# Altium schematic sheet UWB_IMU.SchDoc
size A4; SheetNumber: 2; SheetTotal: 3
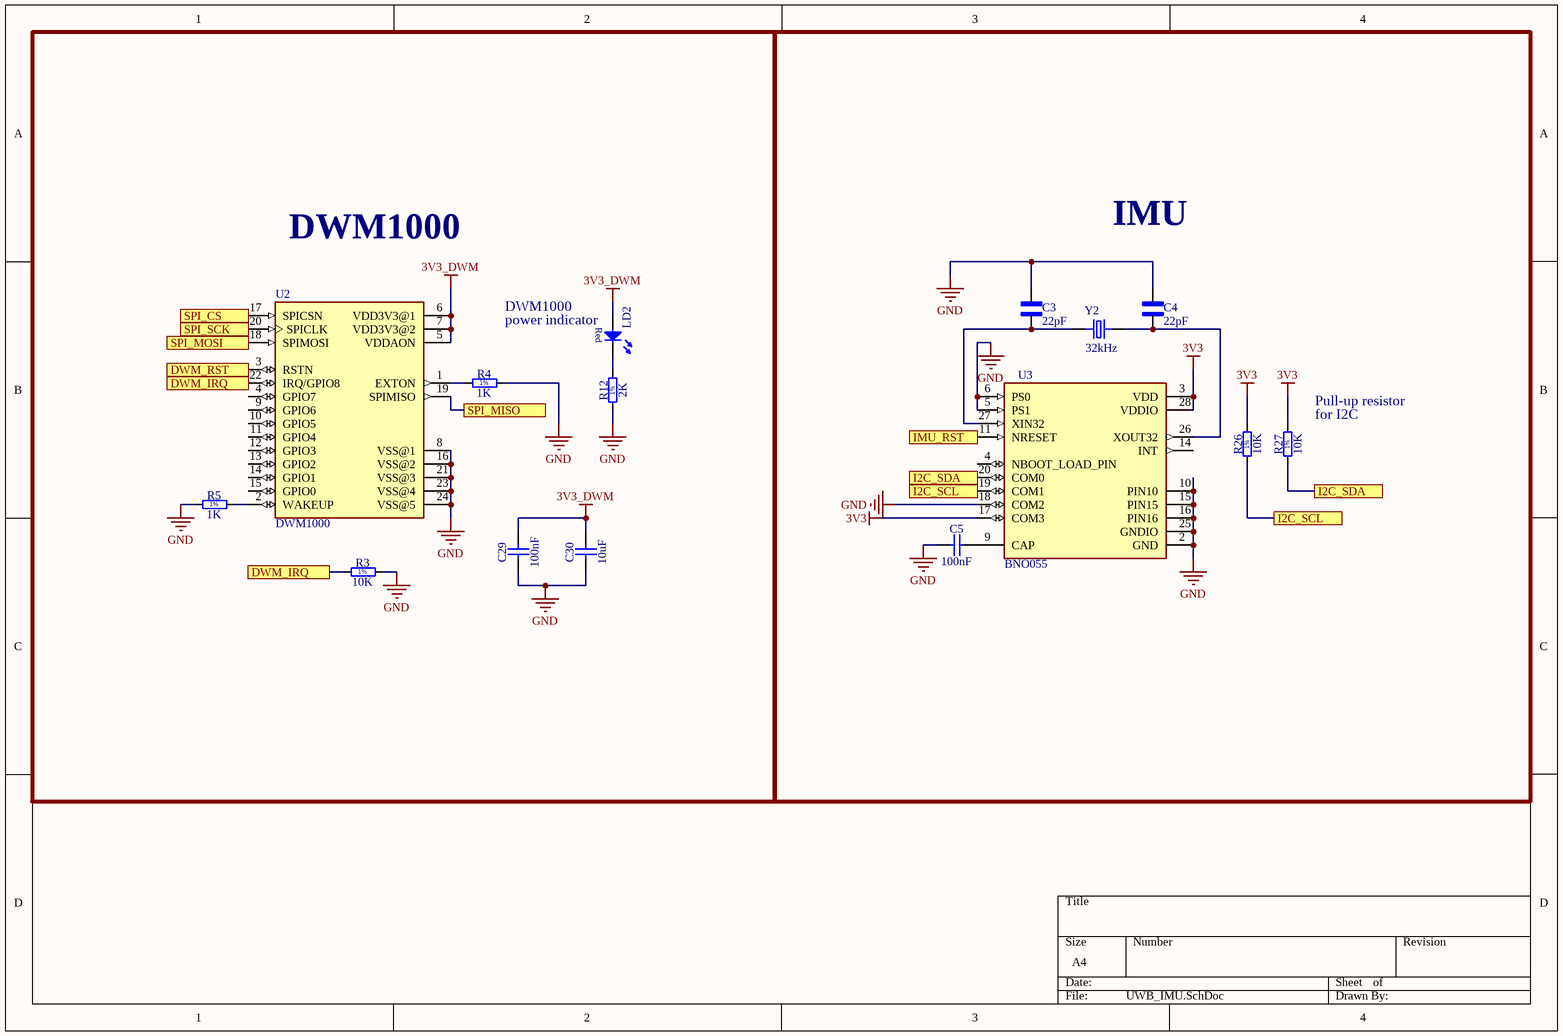
[diagram p0: UWB_IMU.SchDoc]

## Parts
C3  22pF  [CAPC1005X55N]
C4  22pF  [CAPC1005X55N]
C5  100nF  [0603C]
C29  100nF  [0603C]
C30  10uF  [0603C]
LD2  (no value)  [0603 LED]
R3  10K  [0603R]
R4  1K  [0603R]
R5  1K  [0603R]
R12  2K  [0603R]
R26  10K  [0603R]
R27  10K  [0603R]
U2  DWM1000  [XCVR_DWM1000]
U3  BNO055  [LGA28R50P4X10_380X520X100]
Y2  32kHz  [XTAL_ECS-.327-6-34RR-TR]

## Blocks framed on the sheet
DWM1000: C29 C30 LD2 R3-R5 R12 U2
IMU: C3-C5 R26 R27 U3 Y2

## Ports
DWM_IRQ, DWM_RST, I2C_SCL, I2C_SDA, IMU_RST, SPI_CS, SPI_MISO, SPI_MOSI, SPI_SCK

## Nets
3V3: R26.2 R27.2 U3.3(VDD) U3.17(COM3) U3.28(VDDIO)
3V3_DWM: C29.2 C30.2 LD2.2(A) U2.5(VDDAON) U2.6(VDD3V3@1) U2.7(VDD3V3@2)
GND: C3.2 C4.2 C5.1 C29.1 C30.1 R3.2 R4.2 R5.1 R12.1 U2.8(VSS@1) U2.16(VSS@2) U2.21(VSS@3) U2.23(VSS@4) U2.24(VSS@5) U3.2(GND) U3.5(PS1) U3.6(PS0) U3.10(PIN10) U3.15(PIN15) U3.16(PIN16) U3.18(COM2) U3.25(GNDIO)
DWM_IRQ: R3.1 U2.22(IRQ/GPIO8) ; port DWM_IRQ
DWM_RST: U2.3(RSTN) ; port DWM_RST
I2C_SCL: R26.1 U3.19(COM1) ; port I2C_SCL
I2C_SDA: R27.1 U3.20(COM0) ; port I2C_SDA
IMU_RST: U3.11(NRESET) ; port IMU_RST
SPI_CS: U2.17(SPICSN) ; port SPI_CS
SPI_MISO: U2.19(SPIMISO) ; port SPI_MISO
SPI_MOSI: U2.18(SPIMOSI) ; port SPI_MOSI
SPI_SCK: U2.20(SPICLK) ; port SPI_SCK
NetC3_1: C3.1 U3.27(XIN32) Y2.1(I/O)
NetC4_1: C4.1 U3.26(XOUT32) Y2.2(O/I)
NetC5_2: C5.2 U3.9(CAP)
NetLD2_1: LD2.1(C) R12.2
NetR4_1: R4.1 U2.1(EXTON)
NetR5_2: R5.2 U2.2(WAKEUP)

Not connected (* = marked no-connect by the designer): U2 4(GPIO7) 9(GPIO6) 10(GPIO5) 11(GPIO4) 12(GPIO3) 13(GPIO2) 14(GPIO1) 15(GPIO0); U3 4(NBOOT_LOAD_PIN) 14(INT)

## Notes on the sheet
- DWM1000
- (near LD2) power indicator
- (near R27) Pull-up resistor
- (near R27) for I2C
- (in symbol LED Red 1C 2A) Red
- (in symbol Resistor - 1%_1) 1%

## Library data of the parts
C3 C4 = 0402N100J500CT: 10 pF Â±5% 50V Ceramic Capacitor C0G, NP0 0402 (1005 Metric); MF: Walsin Technology; SnapEDA_Link: https://www.snapeda.com/parts/0402N100J500CT/Walsin+Technologies/view-part/?ref=snap; Package: 0402 Walsin Technologies; Value: *; MP: 0402N100J500CT; Check_prices: https://www.snapeda.com/parts/0402N100J500CT/Walsin+Technologies/view-part/?ref=eda
C5 C29 C30 = Capacitor - non polarized: Non-polarised capacitor
LD2 = LED Red 1C 2A
R3-R5 R12 R26 R27 = Resistor - 1%_1: Resistor - 1%
U2 = DWM1000: 802.15.4 IR-UWB Transceiver Module 3.5GHz ~ 6.5GHz Integrated, Chip Surface Mount; MF: Decawave Limited; Package: Module Decawave; Availability: Unavailable; Value: *; MP: DWM1000; SnapEDA_Link: https://www.snapeda.com/parts/DWM1000/Decawave%20Limited/view-part/327593/?ref=snap; Price: None
U3 = BNO055: BNO055 9-axis Absolute Orientation Sensor ( SiP ) w/Sensors and Sensor Fusion; Package: None; Price: None; Value: *; MP: BNO055; Availability: Unavailable
Y2 = ECS-.327-6-34RR-TR: 32.768kHz 20ppm Crystal 6pF 20 kOhm -40C ~ 85C Surface Mount 2-SMD, No Lead 3.2 x 1.5; MF: ECS Inc.; SnapEDA_Link: https://www.snapeda.com/parts/ECS-.327-6-34RR-TR/ECS/view-part/?ref=snap; Package: ECX-34RR-34RR-2 ECS; Value: *; MP: ECS-.327-6-34RR-TR; Check_prices: https://www.snapeda.com/parts/ECS-.327-6-34RR-TR/ECS/view-part/?ref=eda